# EAGLE board RGBW_Controller (EAGLE 9.4.1)
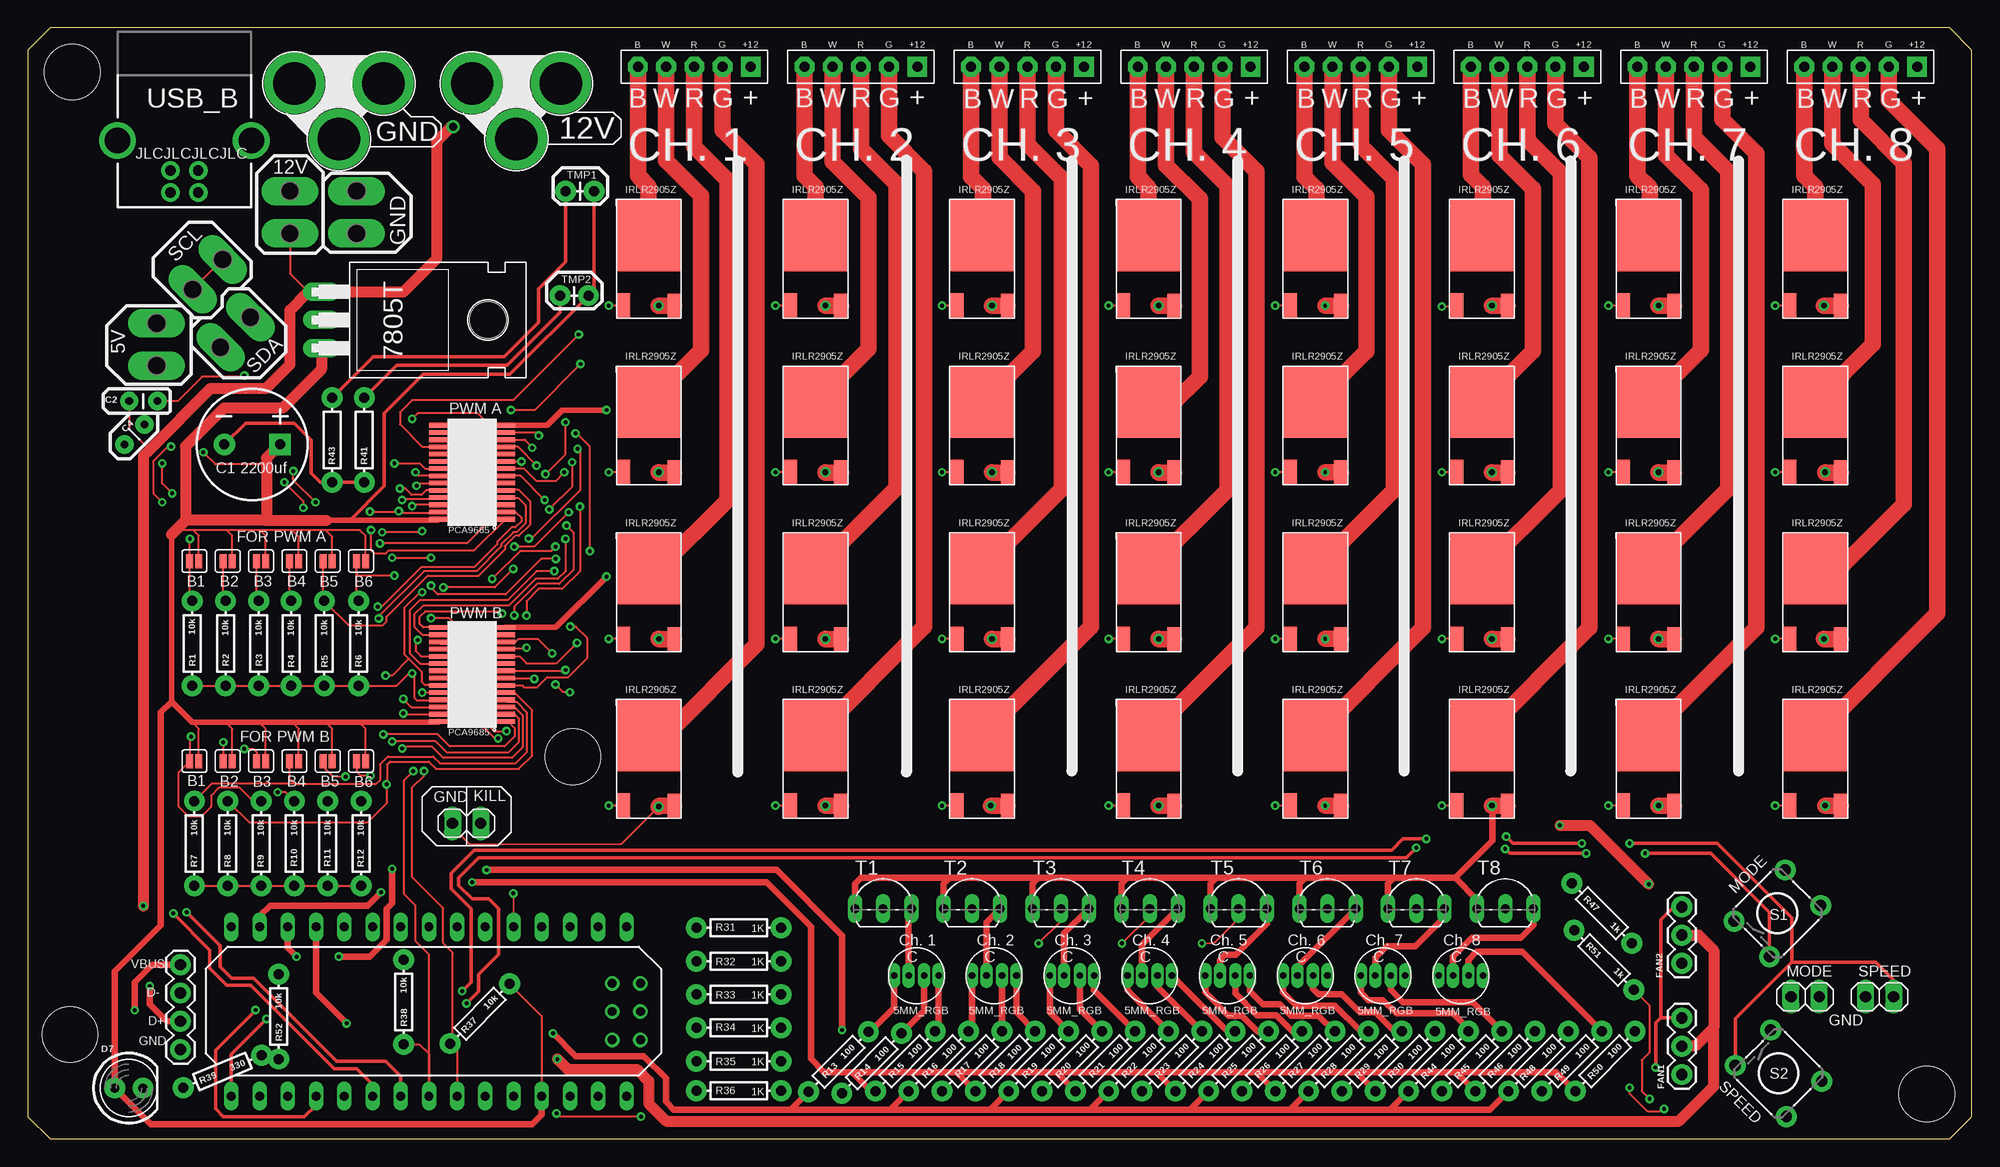
[diagram p1: board, top side]
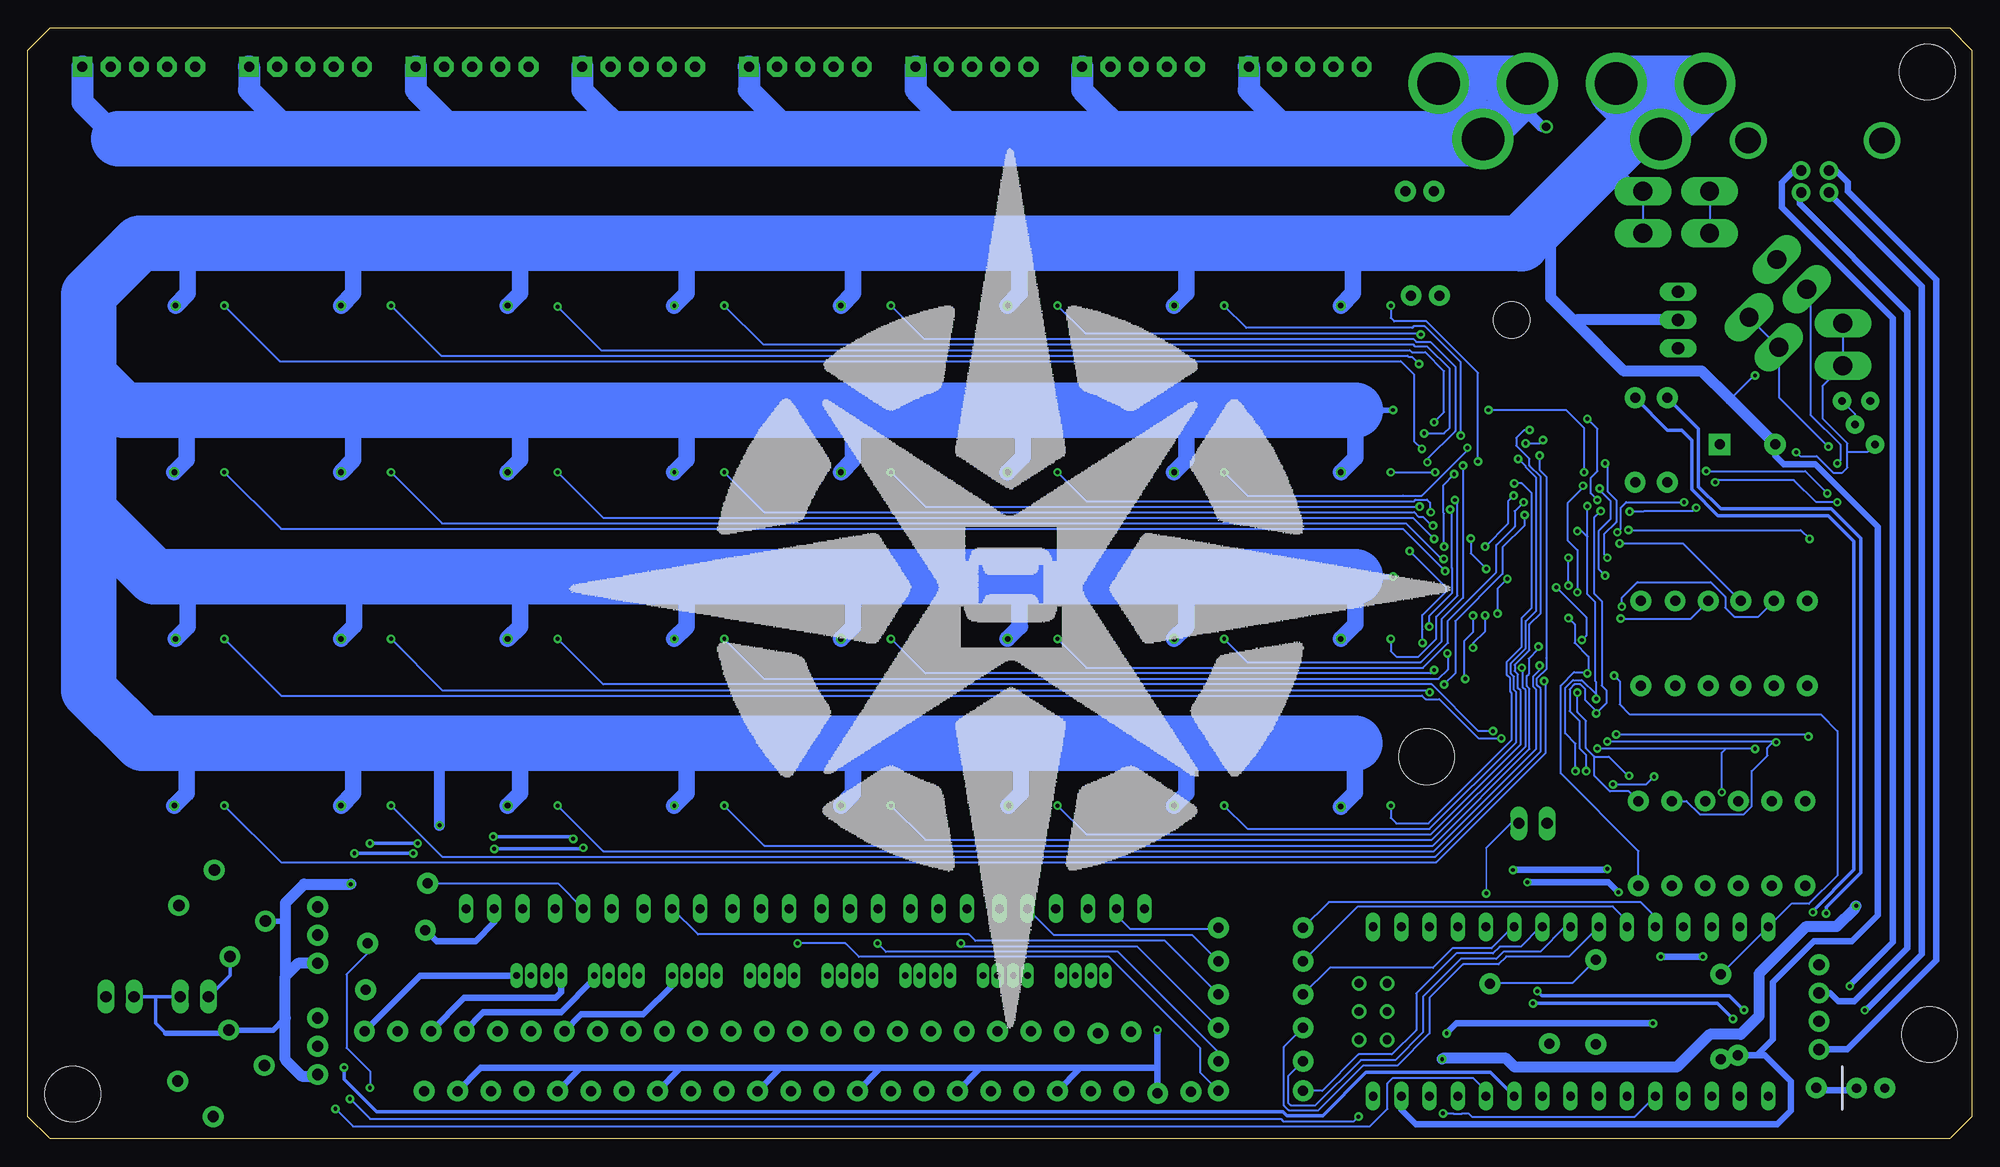
[diagram p2: board, bottom side, seen from below]

Size 175 x 100 mm. Coordinates in mm from the lower left corner, seen from the top.
Outline: 0,98 0,2 2,0 173,0 175,2 175,98 173,100 2,100 0,98
Copper layers (1*16): Top 0.035mm / dielectric 1.5mm / Bottom 0.035mm
Design rules "default": minimum track width 6mil, minimum drill 0.35mm, track to track 6mil, track to pad 6mil, pad to pad 6mil, via to via 6mil, smd to smd 6mil, copper to edge 40mil, drill to drill 6mil, minimum pad ring 10mil, minimum via ring 8mil, stop-mask expansion 4mil, vias tented up to drill 0mil, thermal gap 10mil
Holes 5 mm at 3.8,9.4 4,96.03 170.95,4.05 49.08,34.4

## Footprints (pad centres in the part's own frame; a part is rotated, then mirrored left to right if it is on the bottom)
P2-38-17 = drill 1.702 pad 2.121 long: TP-1 -1.905,0; TP-2 1.905,0
CPOL-RADIAL-5MM-10MM = drill 0.9 pad 1.93 square: + 2.5,0 | drill 0.9 pad 1.93: - -2.5,0
CAP-PTH-2.54 = drill 0.7 pad 1.651: 1 -1.27,0; 2 1.27,0
LED_5MM = drill 0.813 pad 1.88: A -1.27,0; K 1.27,0
1X03 = drill 1.016 pad 1.88: 1 0,0; 2 2.54,0; 3 5.08,0
TO220H = drill 1.118 long: 1 -2.54,-10.16; 2 0,-10.16; 3 2.54,-10.16 | hole 3.302: 0,4.826
USB-B-PTH = drill 0.914 pad 1.676: D+ 4,1.25; D- 5.981,1.25; GND 4,-1.25; VBUS 5.981,-1.25 | drill 2.286: SHLD1 1.282,-6.02; SHLD2 1.282,6.02
SMT-JUMPER_2_NC_PASTE_SILK = smd 0.635 x 1.27: 1 -0.406,0; 2 0.406,0
BANANA_CONN = drill 3.81 pad 5.461: P$1 0,0
1X04 = drill 1.016 pad 1.88: 1 0,0; 2 2.54,0; 3 5.08,0; 4 7.62,0
1X02 = drill 1.016 long: 1 -1.27,0; 2 1.27,0
AXIAL-0.3 = drill 0.9 pad 1.88: P$1 -3.81,0; P$2 3.81,0
AXIAL-0.1 = drill 0.9 pad 1.88: P$1 -1.27,0; P$2 1.27,0
TACTILE_SWITCH_PTH_6.0MM = drill 1.016 pad 1.88: 1 -3.251,2.261; 2 3.251,2.261; 3 -3.251,-2.261; 4 3.251,-2.261
TO92-EBC = drill 0.813 long: B 0,-1.27; C 2.54,-1.27; E -2.54,-1.27
16CH_PWM = smd 0.42 x 1.78: A0 -4.23,-3; A1 -3.58,-3; A2 -2.93,-3; A3 -2.28,-3; A4 -1.63,-3; A5 -1.63,3; EXCL -2.28,3; M0 -0.98,-3; M1 -0.33,-3; M2 0.33,-3; M3 0.98,-3; M4 1.63,-3; M5 2.28,-3; M6 2.93,-3; M7 3.58,-3; M8 4.23,3; M9 3.58,3; M10 2.93,3; M11 2.28,3; M12 1.63,3; M13 0.98,3; M14 0.33,3; M15 -0.33,3; OE -0.98,3; SCL -2.93,3; SDA -3.58,3; VDD -4.23,3; VSS 4.23,-3
MOSFET = smd 5.8 x 6.4: DRAIN 2.9,6.3 | smd 1.2 x 2.2: GATE 0.63,0; SOURCE 5.19,-0.03
NANO = drill 0.8 long: 3.3V -10.16,24.13; 5V -10.16,-1.27; A0 -10.16,19.05; A1 -10.16,16.51; A2 -10.16,13.97; A3 -10.16,11.43; A4 -10.16,8.89; A5 -10.16,6.35; A6 -10.16,3.81; A7 -10.16,1.27; AREF -10.16,21.59; D2 5.08,1.27; D3 5.08,3.81; D4 5.08,6.35; D5 5.08,8.89; D6 5.08,11.43; D7 5.08,13.97; D8 5.08,16.51; D9 5.08,19.05; D10 5.08,21.59; D11 5.08,24.13; D12 5.08,26.67; D13 -10.16,26.67; GND -10.16,-6.35; GND1 5.08,-1.27; RAW -10.16,-8.89; RST -10.16,-3.81; RST1 5.08,-3.81; RX1 5.08,-6.35; TX0 5.08,-8.89 | drill 0.8: ICSP1 -5.08,-10.16; ICSP2 -5.08,-7.62; ICSP3 -2.54,-10.16; ICSP4 -2.54,-7.62; ICSP5 0,-10.16; ICSP6 0,-7.62
5MMRGB = drill 0.6 pad 1 long: BLUE -2,0; GND 0.7,0; GREEN -0.7,0; RED 2,0
5POLE_TERM = drill 0.9 pad 1.778 square: +12 -5.08,1.5 | drill 0.9 pad 1.778 octagon: BLUE 5.08,1.5; GREEN -2.54,1.5; RED 0,1.5; WHITE 2.54,1.5

## Placement (x,y rotation side)
5V  PTR2  [P2-38-17]  11.6,71.5 90 top
12V  PTR2  [P2-38-17]  23.6,83.4 90 top
C1  1mF  [CPOL-RADIAL-5MM-10MM]  20.2,62.5 0 top
C2  22pF  [CAP-PTH-2.54]  10.4,66.4 0 top
C4  22pF  [CAP-PTH-2.54]  9.6,63.4 45 top
D7  [LED_5MM]  9.1,4.58 0 top
FAN1  [1X03]  148.9,5.8 90 top
FAN2  [1X03]  148.9,15.8 90 top
GND  PTR2  [P2-38-17]  29.6,83.4 90 top
IC1  7805T  [TO220H]  36.6,73.7 270 top
J1  USB_B_PTH  [USB-B-PTH]  14.1,91.15 270 top
J1_  JUMPER-SMT_2_NC_PASTE_SILK  [SMT-JUMPER_2_NC_PASTE_SILK]  15,52 180 top
J2  [BANANA_CONN]  48,95 0 top
J2_  JUMPER-SMT_2_NC_PASTE_SILK  [SMT-JUMPER_2_NC_PASTE_SILK]  18,52 180 top
J3  [BANANA_CONN]  44,90 0 top
J3_  JUMPER-SMT_2_NC_PASTE_SILK  [SMT-JUMPER_2_NC_PASTE_SILK]  21,52 180 top
J4  [BANANA_CONN]  40,95 0 top
J4_  JUMPER-SMT_2_NC_PASTE_SILK  [SMT-JUMPER_2_NC_PASTE_SILK]  24,52 180 top
J5  [BANANA_CONN]  32,95 0 top
J5_  JUMPER-SMT_2_NC_PASTE_SILK  [SMT-JUMPER_2_NC_PASTE_SILK]  27,52 180 top
J6  [BANANA_CONN]  28,90 0 top
J6_  JUMPER-SMT_2_NC_PASTE_SILK  [SMT-JUMPER_2_NC_PASTE_SILK]  30,52 180 top
J7  [BANANA_CONN]  24,95 0 top
J7_  JUMPER-SMT_2_NC_PASTE_SILK  [SMT-JUMPER_2_NC_PASTE_SILK]  15,34 180 top
J8  [1X04]  13.75,8.05 90 top
J8_  JUMPER-SMT_2_NC_PASTE_SILK  [SMT-JUMPER_2_NC_PASTE_SILK]  18,34 180 top
J9_  JUMPER-SMT_2_NC_PASTE_SILK  [SMT-JUMPER_2_NC_PASTE_SILK]  21,34 180 top
J10_  JUMPER-SMT_2_NC_PASTE_SILK  [SMT-JUMPER_2_NC_PASTE_SILK]  24,34 180 top
J11_  JUMPER-SMT_2_NC_PASTE_SILK  [SMT-JUMPER_2_NC_PASTE_SILK]  27,34 180 top
J12_  JUMPER-SMT_2_NC_PASTE_SILK  [SMT-JUMPER_2_NC_PASTE_SILK]  30,34 180 top
JP1  [1X02]  39.5,28.4 180 top
JP2  [1X02]  166.7,12.8 180 top
JP3  [1X02]  160,12.8 0 top
R1  10k  [AXIAL-0.3]  26.7,44.6 270 top
R2  10k  [AXIAL-0.3]  23.7,44.6 270 top
R3  10k  [AXIAL-0.3]  20.8,44.6 270 top
R4  10k  [AXIAL-0.3]  17.8,44.6 270 top
R5  10k  [AXIAL-0.3]  14.8,44.6 270 top
R6  10k  [AXIAL-0.3]  18,26.6 270 top
R7  10k  [AXIAL-0.3]  15,26.6 270 top
R8  10k  [AXIAL-0.3]  24,26.6 270 top
R9  10k  [AXIAL-0.3]  27,26.6 270 top
R10  10k  [AXIAL-0.3]  21,26.6 270 top
R11  10k  [AXIAL-0.3]  29.8,44.6 270 top
R12  10k  [AXIAL-0.3]  30,26.6 270 top
R13  100  [AXIAL-0.3]  72.97,6.95 225 top
R14  100  [AXIAL-0.3]  75.97,6.8 225 top
R15  100  [AXIAL-0.3]  79,7 225 top
R16  100  [AXIAL-0.3]  82,7 225 top
R17  100  [AXIAL-0.3]  85,7 225 top
R18  100  [AXIAL-0.3]  88,7 225 top
R19  100  [AXIAL-0.3]  91,7 225 top
R20  100  [AXIAL-0.3]  94,7 225 top
R21  100  [AXIAL-0.3]  97,7 225 top
R22  100  [AXIAL-0.3]  100,7 225 top
R23  100  [AXIAL-0.3]  103,7 225 top
R24  100  [AXIAL-0.3]  106,7 225 top
R25  100  [AXIAL-0.3]  109,7 225 top
R26  100  [AXIAL-0.3]  112,7 225 top
R27  100  [AXIAL-0.3]  115,7 225 top
R28  100  [AXIAL-0.3]  118,7 225 top
R29  100  [AXIAL-0.3]  121,7 225 top
R30  100  [AXIAL-0.3]  124,7 225 top
R31  1k  [AXIAL-0.3]  64,19 0 top
R32  1k  [AXIAL-0.3]  64,16 0 top
R33  1k  [AXIAL-0.3]  64,10 0 top
R34  1k  [AXIAL-0.3]  64,7 0 top
R35  1k  [AXIAL-0.3]  64,4.33 0 top
R36  1k  [AXIAL-0.3]  64,13 0 top
R37  10k  [AXIAL-0.3]  40.7,11.28 225 top
R38  10k  [AXIAL-0.3]  33.85,12.32 270 top
R39  330  [AXIAL-0.3]  17.52,6.08 22.5 top
R40  10  [AXIAL-0.1]  49.2,75.9 0 top
R41  10  [AXIAL-0.3]  30.3,62.9 90 top
R42  10  [AXIAL-0.1]  49.7,85.3 0 top
R43  10  [AXIAL-0.3]  27.4,62.9 90 top
R44  100  [AXIAL-0.3]  127,7 225 top
R45  100  [AXIAL-0.3]  130,7 225 top
R46  100  [AXIAL-0.3]  133,7 225 top
R47  1k  [AXIAL-0.3]  141.7,20.3 135 top
R48  100  [AXIAL-0.3]  136,7 225 top
R49  100  [AXIAL-0.3]  139,7 225 top
R50  100  [AXIAL-0.3]  142,7 225 top
R51  1k  [AXIAL-0.3]  141.9,16.1 135 top
R52  10k  [AXIAL-0.3]  22.6,11 270 top
S1  MOMENTARY-SWITCH-SPST-PTH-6.0MM  [TACTILE_SWITCH_PTH_6.0MM]  157.5,20.3 45 top
S2  MOMENTARY-SWITCH-SPST-PTH-6.0MM  [TACTILE_SWITCH_PTH_6.0MM]  157.6,5.9 315 top
SCL  PTR2  [P2-38-17]  16.2,77.8 45 top
SDA  PTR2  [P2-38-17]  18.7,72.6 45 top
T1  [TO92-EBC]  77,22 0 top
T2  [TO92-EBC]  85,22 0 top
T3  [TO92-EBC]  93,22 0 top
T4  [TO92-EBC]  101,22 0 top
T5  [TO92-EBC]  109,22 0 top
T6  [TO92-EBC]  117,22 0 top
T7  [TO92-EBC]  125,22 0 top
T8  [TO92-EBC]  133,22 0 top
U$1  16CH_PWM  [16CH_PWM]  40,60 90 top
U$2  MOSFET  [MOSFET]  143,75 0 top
U$3  MOSFET  [MOSFET]  143,60 0 top
U$4  MOSFET  [MOSFET]  143,45 0 top
U$5  MOSFET  [MOSFET]  143,30 0 top
U$6  MOSFET  [MOSFET]  83,75 0 top
U$7  MOSFET  [MOSFET]  83,60 0 top
U$8  MOSFET  [MOSFET]  83,45 0 top
U$9  MOSFET  [MOSFET]  83,30 0 top
U$10  MOSFET  [MOSFET]  68,75 0 top
U$11  MOSFET  [MOSFET]  68,60 0 top
U$12  MOSFET  [MOSFET]  68,45 0 top
U$13  MOSFET  [MOSFET]  68,30 0 top
U$14  MOSFET  [MOSFET]  53,75 0 top
U$15  MOSFET  [MOSFET]  53,60 0 top
U$16  MOSFET  [MOSFET]  53,45 0 top
U$17  MOSFET  [MOSFET]  53,30 0 top
U$18  16CH_PWM  [16CH_PWM]  40,41.8 90 top
U$19  MOSFET  [MOSFET]  158,30 0 top
U$20  MOSFET  [MOSFET]  158,45 0 top
U$21  MOSFET  [MOSFET]  158,60 0 top
U$22  MOSFET  [MOSFET]  158,75 0 top
U$23  MOSFET  [MOSFET]  128,30 0 top
U$24  MOSFET  [MOSFET]  128,45 0 top
U$25  MOSFET  [MOSFET]  128,60 0 top
U$26  MOSFET  [MOSFET]  128,75 0 top
U$27  MOSFET  [MOSFET]  113,30 0 top
U$28  MOSFET  [MOSFET]  113,45 0 top
U$29  MOSFET  [MOSFET]  113,60 0 top
U$30  MOSFET  [MOSFET]  113,75 0 top
U$31  MOSFET  [MOSFET]  98,30 0 top
U$32  MOSFET  [MOSFET]  98,45 0 top
U$33  MOSFET  [MOSFET]  98,60 0 top
U$34  MOSFET  [MOSFET]  98,75 0 top
U$35  NANO  [NANO]  45,14 90 top
U$36  5MM_RGB  [5MMRGB]  80,14.7 180 top
U$37  5POLE_TERM  [5POLE_TERM]  60,98 180 top
U$38  5POLE_TERM  [5POLE_TERM]  75,98 180 top
U$39  5POLE_TERM  [5POLE_TERM]  90,98 180 top
U$40  5POLE_TERM  [5POLE_TERM]  105,98 180 top
U$41  5POLE_TERM  [5POLE_TERM]  120,98 180 top
U$42  5POLE_TERM  [5POLE_TERM]  135,98 180 top
U$43  5POLE_TERM  [5POLE_TERM]  150,98 180 top
U$44  5POLE_TERM  [5POLE_TERM]  165,98 180 top
U$45  5MM_RGB  [5MMRGB]  87,14.7 180 top
U$46  5MM_RGB  [5MMRGB]  94,14.7 180 top
U$47  5MM_RGB  [5MMRGB]  101,14.7 180 top
U$48  5MM_RGB  [5MMRGB]  108,14.7 180 top
U$49  5MM_RGB  [5MMRGB]  115,14.7 180 top
U$50  5MM_RGB  [5MMRGB]  122,14.7 180 top
U$51  5MM_RGB  [5MMRGB]  129,14.7 180 top

## Tracks (layer width: path | path; a pad name or v marks a point on that pad's centre or on a via)
5V  (via drill 0.35)
  Top 0.2: J1_.1 15.41,54.3 14.91,54.8 | J2_.1 18.41,54.3 17.91,54.8 | 26.81,54.8 29.9,54.8 30.41,54.29 J6_.1 | 26.81,54.8 23.81,54.8 | 23.81,54.8 20.91,54.8 | 20.91,54.8 17.91,54.8 | 17.91,54.8 14.91,54.8 | 14.91,54.8 12.94,54.8 | J3_.1 21.41,54.3 20.91,54.8 | J4_.1 24.41,54.2 23.81,54.8 | J5_.1 27.41,54.2 26.81,54.8 | J7_.1 15.41,36.89 14.8,37.5 | J8_.1 18.41,36.89 17.8,37.5 | J9_.1 21.41,36.89 20.8,37.5 | J10_.1 24.41,36.89 23.8,37.5 | J11_.1 27.41,36.89 26.8,37.5 | J12_.1 30.41,36.89 29.8,37.5 | U$35.5V 46.27,11.05 43.39,13.93 R37.P$1 | 21.5,60.7 16.9,60.7 v15.8,61.8
  Top 0.3: 29,55.67 32.1,58.77 32.1,65.3 35.6,68.8 43.4,68.8 50.47,75.87 R40.P$2 50.97,76.4 R42.P$2
  Top 0.5: U$1.VDD 36.9,55.67 29,55.67 26.9,55.67 | U$18.VDD 36.93,37.5 29.8,37.5 26.8,37.5 23.8,37.5 20.8,37.5 17.8,37.5 14.8,37.5 12.94,39.36 12.94,54.4 12.94,54.8
  Top 0.6: 12.94,39.36 11.98,38.4 11.98,19.25 7.83,15.1 D7.A 11.09,1.32 45.4,1.32 46.27,2.19 U$35.5V
  Top 1: IC1.3 26.44,69.26 22.94,65.76 17.64,65.76 14.21,62.33 14.21,55.67 | 21.5,55.67 26.9,55.67 | C1.+ 21.5,61.3 21.5,60.7 21.5,55.67 | 21.5,55.67 14.21,55.67 | 14.21,55.67 12.94,54.4
  Bottom 0.2: R38.P$1 35.92,14.07 43.29,14.07 R37.P$1 | 5V.TP-2 5V.TP-1 13.4,67.8 13.4,64.8 11.2,62.6 11.2,61.8 | v15.8,61.8 15.45,61.45 13.95,61.45 12.47,59.97 11.64,59.97 11.2,60.41 11.2,61.8 | C4.1 9.4,61.8 11.2,61.8
12V  (via drill 0.35, 0.75)
  Top 0.2: 12V.TP-1 23.6,77.88 25.24,76.24 | C2.1 9.13,63.87 10.96,62.04
  Top 1: v38.3,91.1 38.1,91.1 36.8,89.8 36.8,79.2 33.8,76.2 26.48,76.2 IC1.1 25.24,76.24 23.6,74.6 23.6,69.7 21.44,67.54 16.46,67.54 10.96,62.04 10.4,61.48 v10.4,20.98 | FAN2.2 150.43,18.34 151.78,16.99 151.78,10 | 151.78,10 150.12,8.34 FAN1.2 | v47.67,7.17 48.6,6.25 54.85,6.25 55.9,5.2 55.9,3.17 57.48,1.6 148.65,1.6 151.78,4.72 151.78,10
  Bottom 0.2: 12V.TP-2 12V.TP-1
  Bottom 1: v38.3,91.1 38.7,91.1 40,92.4 J4.P$1 | v10.4,20.98 10.5,20.88 10.5,20.77 12.15,19.12 14.88,19.12 19.15,14.85 19.15,11.05 20.8,9.4 23.6,9.4 26.55,6.45 41.14,6.45 41.99,7.3 47.55,7.3 v47.67,7.17
  Bottom 2: U$37.+12 65.08,94.38 60.7,90 | U$38.+12 80.08,94.38 75.7,90 | U$39.+12 95.08,94.38 90.7,90 | U$40.+12 110.08,94.38 105.7,90 | U$41.+12 125.08,94.38 120.7,90 | U$42.+12 140.08,94.38 135.7,90 | U$43.+12 155.08,94.38 150.7,90 | U$44.+12 170.08,93.28 166.8,90 | J3.P$1 43.65,90.35 43.65,90.65
  Bottom 4: J4.P$1 40,94.3 43.65,90.65 J2.P$1 47.5,95.5 40.5,95.5 J4.P$1
  Bottom 5: J3.P$1 60.7,90 75.7,90 90.7,90 105.7,90 120.7,90 135.7,90 150.7,90 166.8,90
GND  (via drill 0.35, 0.5)
  Top 0.152: 56.87,29.97 53.4,26.5 39.8,26.5
  Top 0.2: U$1.VSS 41.57,64.23 40.5,65.3 35.1,65.3 v34.6,64.8 | U$18.VSS 38.77,46.03 37.93,46.87 v36.3,46.87 | U$18.EXCL 36.98,39.5 35,39.5 34.8,39.7 34.8,41.7 v34.6,41.9 34.31,41.9 33.2,40.79 R11.P$2 R1.P$2 R2.P$2 R3.P$2 R4.P$2 R5.P$2 | U$1.EXCL 36.88,57.6 33.8,57.6 v33.7,57.5 | R7.P$2 R6.P$2 R10.P$2 R8.P$2 R9.P$2 R12.P$2 | C2.2 13.5,66.4 15.7,68.6 19.4,68.6 v19.5,68.7 | 39.8,26.5 38.23,28.07 JP1.2
  Top 0.3: C1.- 19.6,64.4 24,64.4 25.5,62.9 25.5,59.9 26.31,59.09 R43.P$1 R41.P$1
  Top 0.5: U$1.VSS 46.73,64.23 48.1,65.6 v52.1,65.6 | U$18.VSS 47.53,46.03 v52.1,50.6
  Top 0.6: 83,23.5 91,23.5 | 91,23.5 99,23.5 | 99,23.5 107,23.5 | 107,23.5 115,23.5 | 115,23.5 123,23.5 | 123,23.5 128.5,23.5 | 128.5,23.5 131.83,26.83 131.83,29.97 | 115,23.5 114.46,22.96 T6.E | T5.E 106.46,22.96 107,23.5 | T4.E 98.46,22.96 99,23.5 | T3.E 90.46,22.96 91,23.5 | T2.E 82.46,22.96 83,23.5 | T1.E 74.46,22.96 75,23.5 83,23.5 | T7.E 122.46,22.96 123,23.5 | 128.5,23.5 130.46,21.54 T8.E
  Top 1: v145.93,22.93 140.62,28.23 v137.93,28.23
  Top 1.5: U$22.SOURCE 161.73,74.97 v161.7,75 | U$2.SOURCE 146.83,74.97 v146.8,75 | U$26.SOURCE 131.83,74.97 v131.8,75 | U$34.SOURCE 101.83,74.97 v101.8,75 | U$6.SOURCE 86.83,74.97 v86.8,75 | U$10.SOURCE 71.83,74.97 v71.8,75 | U$14.SOURCE 56.83,74.97 v56.8,75 | U$21.SOURCE 161.83,59.97 v161.8,60 | U$3.SOURCE 146.83,59.97 v146.8,60 | U$25.SOURCE 131.83,59.97 v131.8,60 | U$33.SOURCE 101.83,59.97 v101.8,60 | U$7.SOURCE 86.83,59.97 v86.8,60 | U$11.SOURCE 71.83,59.97 v71.8,60 | U$15.SOURCE 56.83,59.97 v56.8,60 | U$16.SOURCE 56.83,44.97 v56.8,45 | U$12.SOURCE 71.83,44.97 v71.8,45 | U$8.SOURCE 86.83,44.97 v86.8,45 | U$32.SOURCE 101.83,44.97 v101.8,45 | U$24.SOURCE 131.83,44.97 v131.8,45 | U$4.SOURCE 146.83,44.97 v146.8,45 | U$20.SOURCE 161.73,44.97 v161.7,45 | U$17.SOURCE 56.87,29.97 v56.8,29.9 | U$13.SOURCE 71.83,29.97 v71.8,30 | U$9.SOURCE 86.73,29.97 v86.7,30 | U$31.SOURCE 101.83,29.97 v101.8,30 | U$23.SOURCE 131.83,29.97 v131.8,30 | U$5.SOURCE 146.83,29.97 v146.8,30 | U$19.SOURCE 161.83,29.97 v161.8,30 | v116.8,45 118.16,45 U$28.SOURCE | v116.8,60 118.16,60 U$29.SOURCE | v116.8,75 118.16,75 U$30.SOURCE | v116.8,30 118.16,30 U$27.SOURCE
  Bottom 0.2: v34.6,64.8 33.7,63.9 33.7,60.1 34.3,59.5 34.3,58.1 v33.7,57.5 | 34.6,42 v34.6,41.9 | v36.3,46.87 35.73,46.3 35.73,44.64 34.5,43.41 34.5,42 34.6,42 | 34.6,42 35.8,42 37,40.8 37,32.89 30,25.89 R12.P$2 | R39.P$2 21.39,7.19 R52.P$2 | GND.TP-1 GND.TP-2 32.74,88.45 32.75,88.45 | C4.2 10.5,65.23 C2.2 | 21.75,66.55 19.6,68.7 v19.5,68.7
  Bottom 0.3: 162.6,9.5 163.5,10.4 163.5,12.8 | JP3.2 163.5,12.8 | JP2.2 163.5,12.8
  Bottom 0.5: v52.1,65.6 55.5,65.6 | v52.1,50.6 55.5,50.6 | S1.1 151.82,19.6 | 151.82,19.6 | 151.82,10.9 152.93,9.8 S2.1 157.2,9.5 162.6,9.5
  Bottom 0.6: U$35.GND 51.35,2.64 50.03,1.32 17.48,1.32 16.27,2.52 16.27,5.2 18.61,7.53 19.35,7.53 | R39.P$2 19.35,7.53 | 19.35,7.53 17.91,8.97 17.91,14.11 14.22,17.8 10.8,17.8 8.47,20.13 8.47,55.08 14.1,60.7 16.9,60.7 17.7,61.5 C1.-
  Bottom 1: 40.52,80.55 37.9,80.55 37.9,75.7 35.75,73.55 | FAN2.1 150.68,15.8 151.82,14.65 | 151.82,14.65 151.82,10.9 151.82,7.12 150.35,5.65 149.05,5.65 FAN1.1 | 151.82,14.65 151.82,19.6 151.82,21.23 150.12,22.93 v145.93,22.93 | v137.93,28.23 137.93,35.4 137.72,35.6 | C1.- 21.75,66.55 24.3,69.1 31.3,69.1 35.75,73.55 | IC1.2 35.6,73.7 35.75,73.55
  Bottom 1.5: v161.7,75 160.6,76.1 160.6,80.6 | v146.8,75 145.7,76.1 145.7,80.6 | v131.8,75 130.7,76.1 130.7,80.6 | v116.8,75 115.7,76.1 115.7,80.6 | v101.8,75 100.7,76.1 100.7,80.6 | v86.8,75 85.7,76.1 85.7,80.6 | v71.8,75 70.7,76.1 70.7,80.6 | v56.8,75 55.7,76.1 55.7,80.6 | v161.8,60 160.7,61.1 160.7,65.6 | v146.8,60 145.7,61.1 145.7,65.6 | v131.8,60 130.7,61.1 130.7,65.6 | v116.8,60 115.7,61.1 115.7,65.6 | v101.8,60 100.7,61.1 100.7,65.6 | v71.8,60 70.7,61.1 70.7,65.6 | v56.8,60 55.5,61.3 55.5,65.6 | v56.8,45 55.5,46.3 55.5,50.6 | v71.8,45 70.7,46.1 70.7,50.6 | v86.8,45 85.7,46.1 85.7,49.4 86.3,50 85.7,50.6 84.9,50.6 | v101.8,45 100.7,46.1 100.7,50.6 | v116.8,45 115.7,46.1 115.7,50.6 | v146.8,45 145.6,46.2 145.6,50.6 | v161.7,45 160.6,46.1 160.6,50.6 | v131.8,45 130.7,46.1 130.7,50.6 | v56.8,29.9 55.55,31.15 55.55,35.6 | v71.8,30 70.7,31.1 70.7,35.6 | v86.7,30 85.6,31.1 85.6,35.6 | v101.8,30 100.7,31.1 100.7,35.6 | v116.8,30 115.7,31.1 115.7,35.6 | v131.8,30 130.7,31.1 130.7,36.7 131.2,36.2 131.2,35.6 | v146.8,30 145.7,31.1 145.7,35.6 | v86.8,60 85.4,61.4 85.4,65.6 | v161.8,30 160.7,31.1 160.7,35.6
  Bottom 5: 28,90.4 28,91 J7.P$1 J5.P$1 | 28,90.4 J6.P$1 | 169.5,68.7 169.5,76 164.9,80.6 160.6,80.6 145.7,80.6 130.7,80.6 115.7,80.6 100.7,80.6 85.7,80.6 70.7,80.6 55.7,80.6 40.6,80.6 | 169.5,68.7 169.5,56.5 | 169.5,56.5 169.5,40.4 164.7,35.6 160.7,35.6 145.7,35.6 137.72,35.6 131.2,35.6 115.7,35.6 100.7,35.6 85.6,35.6 70.7,35.6 55.55,35.6 | 169.5,56.5 163.6,50.6 160.6,50.6 145.6,50.6 130.7,50.6 115.7,50.6 100.7,50.6 84.9,50.6 70.7,50.6 55.5,50.6 | 169.5,68.7 166.4,65.6 160.7,65.6 145.7,65.6 130.7,65.6 115.7,65.6 100.7,65.6 85.4,65.6 70.7,65.6 55.5,65.6 | 40.6,80.6 32.75,88.45 30.4,90.8 30.4,94.4 31,95 J5.P$1 | 40.52,80.55 40.55,80.55 40.6,80.6 | J5.P$1 32,94.4 28,90.4
N$1  (via drill 0.35)
  Top 0.2: U$18.A5 v35.5,40.17 | J12_.2 29.59,33.06 29.98,32.68 v30.85,32.68
  Bottom 0.2: v30.85,32.68 30.95,32.68 32.68,34.41 33.96,34.41 | 33.96,34.41 34.73,35.17 34.73,37.63 35.5,38.4 v35.5,40.17 | R12.P$1 30.86,31.27 32.56,31.27 33.96,32.67 33.96,34.41
N$2  (via drill 0.35)
  Top 0.6: R15.P$2 75.91,4.31 74.21,6.01 | v40,23.1 66.5,23.1 70.5,19.1 70.5,7.2 71.69,6.01 74.21,6.01 | v31.8,22.2 30.6,21 21.8,21 20.87,20.07 U$35.D11 | 74.21,6.01 83.61,6.01 | 83.61,6.01 R18.P$2 | 83.61,6.01 92.61,6.01 | 92.61,6.01 R21.P$2 | 92.61,6.01 101.61,6.01 | 101.61,6.01 R24.P$2 | 101.61,6.01 110.61,6.01 | 110.61,6.01 119.61,6.01 | 119.61,6.01 R30.P$2 | 119.61,6.01 128.61,6.01 | 128.61,6.01 R46.P$2 | 128.61,6.01 137.61,6.01 R50.P$2 | R27.P$2 110.61,6.01
  Bottom 0.6: v40,23.1 32.7,23.1 v31.8,22.2
N$3
  Top 0.6: U$36.RED 78,11.8 75.84,9.64 R13.P$1
N$4
  Top 0.6: U$36.GREEN 80.7,11.53 R14.P$1
N$5  (via drill 0.35)
  Top 0.2: R11.P$1 29.59,48.62 29.59,50.9 | 29.59,50.9 J6_.2 | v33,50.7 29.79,50.7 29.59,50.9 | v33.5,58.54 33.96,58.54 34.55,57.95 35.45,57.95 35.87,58.37 U$1.A5
  Bottom 0.2: v33,50.7 33.6,51.3 33.6,54.7 32.5,55.8 32.5,57.4 33.45,58.35 33.45,58.49 v33.5,58.54
N$6
  Top 0.6: U$36.BLUE 82,10 R15.P$1
N$7  (via drill 0.35)
  Top 0.2: U$19.GATE v157.3,30 | v38.5,41.2 38.23,41.47 U$18.M15
  Bottom 0.2: v157.3,30 152.2,24.9 48.2,24.9 38.4,34.7 38.4,41.1 v38.5,41.2
N$8  (via drill 0.35)
  Top 0.2: U$20.GATE v157.3,45 | v42.35,36.05 42.05,36.05 39.8,38.29 39.8,40.81 38.48,42.13 U$18.M14
  Bottom 0.2: v157.3,45 152.2,39.9 49.49,39.9 49.16,39.57 47.92,39.57 44.4,36.05 v42.35,36.05
N$9  (via drill 0.35)
  Top 0.2: U$21.GATE v157.3,60 | v47.4,51.1 45.8,51.1 43.2,48.5 35.3,48.5 34.4,47.6 34.4,43.7 35.32,42.78 U$18.M13
  Bottom 0.2: v157.3,60 152.2,54.9 51.2,54.9 v47.4,51.1
N$10  (via drill 0.35)
  Top 0.2: U$2.GATE v142.3,75 | U$1.M15 35.23,59.67 v34.9,60 | v49.75,69.74 45.61,65.6 v43.5,65.6
  Bottom 0.2: v142.3,75 137.8,70.5 50.8,70.5 50.65,70.35 50.36,70.35 v49.75,69.74 | v34.9,60 34.9,64 36.5,65.6 v43.5,65.6
N$11  (via drill 0.35)
  Top 0.2: U$3.GATE v142.3,60 | v47.53,52.2 46.23,52.2 43.03,49 36.9,49 36.3,49.6 v36.3,49.8 | v33,60.8 35.3,60.8 35.77,60.33 U$1.M14 | v32.8,52.3 v36.3,52.3
  Bottom 0.2: v142.3,60 137.7,55.4 50.93,55.4 47.73,52.2 v47.53,52.2 | v33,60.8 32.8,60.6 32.8,58.3 32,57.5 32,55.5 33.1,54.4 33.1,52.6 v32.8,52.3 | v36.3,49.8 v36.3,52.3
N$12  (via drill 0.35)
  Top 0.2: U$4.GATE v142.3,45 | v48.8,40.2 48.2,40.2 v47.5,40.9 | U$1.M13 37.01,60.99 38.2,60.99 38.74,60.45 38.74,57.66 v40.25,56.15
  Bottom 0.2: v142.3,45 137.7,40.4 49,40.4 v48.8,40.2 | v47.5,40.9 46.5,41.9 46.5,46.6 42.25,50.85 42.25,53.25 40.25,55.25 v40.25,56.15
N$13  (via drill 0.35)
  Top 0.2: U$5.GATE v142.3,30 | U$1.M12 38.77,61.63 v38.9,61.5
  Bottom 0.2: v142.3,30 137.7,25.4 48.3,25.4 38.8,34.9 38.8,40.51 39.13,40.84 39.13,41.47 38.27,42.33 38.27,43.26 38.3,43.29 38.3,59.6 38.9,60.2 v38.9,61.5
N$14
  Bottom 0.6: R39.P$1 13.79,4.4 10.54,4.4 D7.K
N$15
  Top 1.5: U$43.BLUE 144.92,86.68 146,85.6 146,81.4 U$2.DRAIN
N$16
  Top 0.6: U$45.RED 85,10 R16.P$1
N$17
  Top 0.6: U$45.GREEN R17.P$1
N$18  (via drill 0.35)
  Top 0.2: R5.P$1 14.59,48.62 J1_.2 v14.59,53.99 v14.6,54 | v30.9,54.8 30.87,54.77 30.87,53.04 31.21,52.7 32.23,52.7 32.5,52.97 40.2,52.97 U$1.A0
  Bottom 0.2: v30.9,54.8 15.4,54.8 v14.6,54
N$19  (via drill 0.35)
  Top 0.2: U$6.GATE v82.3,75 | v49.6,72.39 43.7,66.49 34.59,66.49 33.5,65.4 33.5,64.3 35.52,62.28 U$1.M11
  Bottom 0.2: v82.3,75 79.8,72.5 49.71,72.5 v49.6,72.39
N$20  (via drill 0.35)
  Top 0.2: U$7.GATE v82.3,60 | v48.7,56.4 45.6,53.3 v43.8,53.3 | U$1.M10 37.03,62.9 v38.6,62.9 | v40.16,62.6 40.16,58.97 v41.23,57.9
  Bottom 0.2: v82.3,60 79.7,57.4 50.19,57.4 50.06,57.53 49.04,57.53 48.77,57.26 48.77,56.47 v48.7,56.4 | v40.16,62.6 38.9,62.6 v38.6,62.9 | v43.8,53.3 41.73,55.37 41.73,57.4 v41.23,57.9
N$21  (via drill 0.35)
  Top 0.2: U$8.GATE v82.3,45 | U$1.M9 37.01,63.59 38.9,63.59 39.53,62.96 39.53,62.34 39.7,62.17 39.7,57.94 v40.34,57.3
  Bottom 0.2: v82.3,45 79.7,42.4 49.4,42.4 47.15,44.65 47.15,46.64 42.8,51 42.8,53.44 41.13,55.1 41.13,56.5 v40.34,57.3
N$22  (via drill 0.35)
  Top 0.2: U$9.GATE v82.3,30 | v39.8,63.8 39.37,64.23 U$1.M8
  Bottom 0.2: v82.3,30 79.7,27.4 48.7,27.4 40.6,35.5 40.6,40.31 40.84,40.56 40.84,41.81 41.13,42.1 41.13,42.66 39.8,43.99 39.8,46.3 38.8,47.3 38.8,59.6 39.8,60.6 39.8,61.2 41,62.4 41,63.1 40.3,63.8 v39.8,63.8
N$23
  Top 0.6: U$45.BLUE 89,11.39 R18.P$1
N$24
  Top 0.6: U$46.RED 92,11.39 R19.P$1
N$25
  Top 0.6: U$46.GREEN 94.7,11.69 R20.P$1
N$26
  Top 0.6: U$46.BLUE 96,13.39 R21.P$1
N$27  (via drill 0.35)
  Top 0.2: U$22.GATE v157.3,75 | v49.5,62.1 49.7,61.9 49.7,58.4 45.33,54.03 v45.1,54.03 | v43.7,51.3 42.03,49.63 v37.4,49.63 | v35.1,44.9 34.9,44.7 34.9,43.93 35.4,43.43 U$18.M12
  Bottom 0.2: v157.3,75 152.3,70 51.4,70 50.2,68.8 50.2,62.8 v49.5,62.1 | v45.1,54.03 45.1,52.7 v43.7,51.3 | v37.4,49.63 34.7,46.93 34.7,45.3 v35.1,44.9
N$28  (via drill 0.35)
  Top 0.2: U$10.GATE v67.3,75 | U$1.M7 45.72,63.58 v46,63.3
  Bottom 0.2: v67.3,75 65.3,73 50.37,73 50.24,73.12 49.24,73.12 46,69.89 v46,63.3
N$29  (via drill 0.35)
  Top 0.2: U$11.GATE v67.3,60 | U$1.M6 44.73,62.93 45.4,62.26 v45.4,62.2
  Bottom 0.2: v67.3,60 65.2,57.9 51.2,57.9 49.5,57.9 45.4,62 v45.4,62.2
N$30  (via drill 0.35)
  Top 0.2: U$12.GATE v67.3,45 | v45.8,60.6 44.12,62.28 U$1.M5
  Bottom 0.2: v67.3,45 65.2,42.9 49.6,42.9 47.7,44.8 47.7,46.8 45.8,48.7 v45.8,60.6
N$31  (via drill 0.35)
  Top 0.2: U$13.GATE v67.3,30 | v40.83,61.2 41.26,61.63 U$1.M4
  Bottom 0.2: v67.3,30 65.2,27.9 48.8,27.9 41,35.7 41,40.22 41.2,40.41 41.2,41.59 41.48,41.88 41.48,42.81 40.15,44.14 40.15,46.6 39.2,47.55 39.2,59.5 40.15,60.46 40.15,60.52 v40.83,61.2
N$32
  Top 0.6: U$47.RED 99,13.39 R22.P$1
N$33
  Top 0.6: U$47.GREEN 101.7,13.69 R23.P$1
N$34
  Top 0.6: U$47.BLUE 108.01,9.69 R24.P$1
N$35
  Top 0.6: U$48.RED 106,13.2 108.1,11.1 109.3,11.1 110.71,9.69 R25.P$1
N$36
  Top 1.5: U$44.BLUE 159.92,86.68 160.9,85.7 U$22.DRAIN
N$37  (via drill 0.35)
  Top 0.2: U$14.GATE v52.3,75 | v44.45,60.96 43.02,60.96 U$1.M3
  Bottom 0.2: v52.3,75 52.3,73.9 51.98,73.58 49.08,73.58 44.45,68.95 v44.45,60.96
N$38  (via drill 0.35)
  Top 0.2: U$15.GATE v52.3,60 | v48.3,60 47.5,59.2 45.8,59.2 44.67,60.33 U$1.M2
  Bottom 0.2: v52.3,60 v48.3,60
N$39  (via drill 0.35)
  Top 0.2: U$16.GATE v52.3,45 | v46.53,57.5 44.36,59.67 U$1.M1
  Bottom 0.2: v52.3,45 52.3,43.9 51.8,43.4 49.8,43.4 48.2,45 48.2,47 46.3,48.9 46.3,57.27 v46.53,57.5
N$40  (via drill 0.35)
  Top 0.2: U$17.GATE v52.3,30 | v41.18,59 41.2,59.02 U$1.M0
  Bottom 0.2: v52.3,30 52.3,28.9 51.8,28.4 48.9,28.4 41.4,35.9 41.4,40.12 41.55,40.27 41.55,41.45 41.84,41.74 41.84,42.95 40.51,44.28 40.51,46.9 39.6,47.8 39.6,58.1 40.5,59 v41.18,59
N$41
  Top 0.6: U$48.GREEN 108.7,13.1 110.67,11.13 112.41,11.13 113.84,9.69 R26.P$1
N$42
  Top 0.6: U$48.BLUE 110,13.3 111.2,12.1 112.7,12.1 113.7,11.1 116.2,11.1 117.61,9.69 R27.P$1
N$43
  Top 0.6: U$49.RED 113,13.2 114.2,12 117.69,12 119.99,9.69 R28.P$1
N$44
  Top 0.6: U$49.GREEN 115.7,13.5 116.2,13 118.3,13 119.9,11.4 121.3,11.4 121.75,10.95 123.01,9.69 R29.P$1
N$45
  Top 1.5: U$44.WHITE 162.46,89.54 166.1,85.9 166.1,71.5 U$21.DRAIN
N$46
  Top 1.5: U$44.RED 165,91.7 168.9,87.8 168.9,57.1 163.1,51.3 U$20.DRAIN
N$47
  Top 1.5: U$44.GREEN 167.54,93.46 171.9,89.1 171.9,47.3 U$19.DRAIN
N$48  (via drill 0.35)
  Top 0.2: R4.P$1 17.59,48.62 J2_.2 | U$1.A1 43.92,56.41 44.44,55.88 44.44,55.58 43.9,55.03 43.57,55.03 42.27,53.73 42.27,53.52 40.2,51.45 35.42,51.45 31.87,47.9 v31.5,47.9
  Bottom 0.2: v31.5,47.9 31.5,48.7 30.1,50.1 23.5,50.1 22.19,48.79 22.19,47.82 21.38,47.01 19.2,47.01 R4.P$1
N$49  (via drill 0.35)
  Top 0.2: U$23.GATE v127.3,30 | v38.9,42.6 38.14,43.36 38.14,43.74 37.81,44.08 U$18.M11
  Bottom 0.2: v127.3,30 123.2,25.9 48.4,25.9 39.2,35.1 39.2,40.41 39.48,40.69 39.48,41.62 38.9,42.2 v38.9,42.6
N$50  (via drill 0.35)
  Top 0.2: U$24.GATE v127.3,45 | U$18.M10 37.19,44.54 37.99,44.54 38.14,44.4 38.14,44.25 39.53,42.86 39.53,41.58 40.15,40.95 40.15,38.54 41.99,36.7 v43.1,36.7
  Bottom 0.2: v127.3,45 123.2,40.9 48.6,40.9 44.4,36.7 v43.1,36.7
N$51  (via drill 0.35)
  Top 0.2: U$25.GATE v127.3,60 | U$18.M9 35.52,45.38 34.8,46.1 34.8,47.2 35.6,48 43.3,48 45.7,50.4 47.7,50.4 48.4,51.1 v48.4,54
  Bottom 0.2: v127.3,60 123.2,55.9 50.3,55.9 v48.4,54
N$52  (via drill 0.35)
  Top 0.2: U$26.GATE 128.53,74.9 v127.3,74.9 | U$18.M8 35.57,46.03 35.3,46.3 35.3,47 35.8,47.5 42.46,47.5 v42.69,47.27 | v41.8,50.4 44.35,52.95 47.15,52.95 v47.5,53.3 | v46.6,59.83 48.4,61.63 v48.4,64.5
  Bottom 0.2: v127.3,74.9 123.4,71 50.6,71 50.4,70.8 49.2,70.8 47.5,69.1 47.5,65.4 v48.4,64.5 | v42.69,47.27 42.69,49.51 v41.8,50.4 | v47.5,53.3 47.5,56.3 47.59,56.38 47.59,58.81 46.6,59.8 v46.6,59.83
N$53
  Top 1.5: U$42.BLUE 129.92,86.78 131,85.7 131,81.4 U$26.DRAIN
N$54
  Top 1.5: U$42.WHITE 132.46,88.54 135.5,85.5 135.5,70.9 U$25.DRAIN
N$55
  Top 1.5: U$42.RED 135,89.9 138,86.9 138,58.4 U$24.DRAIN
N$56
  Top 1.5: U$42.GREEN 137.54,91.36 140.6,88.3 140.6,46 U$23.DRAIN
N$57  (via drill 0.35)
  Top 0.2: U$27.GATE v112.3,30 | v39,44.3 39,44.7 39.7,45.4 42.98,45.4 U$18.M7
  Bottom 0.2: v112.3,30 108.7,26.4 48.5,26.4 39.8,35.1 39.8,40.51 40.03,40.75 40.03,41.67 39.87,41.84 39.87,43.23 39,44.1 v39,44.3
N$58  (via drill 0.35)
  Top 0.2: U$28.GATE v112.3,45 | U$18.M6 43.01,44.72 43.9,44.72 44.18,45 45.9,45 v47.2,43.7
  Bottom 0.2: v112.3,45 108.7,41.4 48.01,41.4 47.17,42.24 47.17,43.67 v47.2,43.7
N$59  (via drill 0.35)
  Top 0.2: U$29.GATE v112.3,60 | v48.5,55.2 49.13,54.57 49.13,51.23 47.85,49.95 45.85,49.95 43.8,47.9 v43.8,47.11 | v44.9,44.2 44.8,44.1 43.02,44.1 U$18.M5
  Bottom 0.2: v112.3,60 108.7,56.4 50.19,56.4 49.76,55.97 49.37,55.97 48.6,55.2 v48.5,55.2 | v44.9,44.2 44.9,44.6 43.8,45.7 v43.8,47.11
N$60  (via drill 0.35)
  Top 0.2: U$30.GATE v112.3,75 | U$18.M4 44.27,43.43 44.9,42.8 47.6,42.8 v49.45,44.65 | v50.6,52.9 50.6,62.3 49.4,63.5 v49.3,63.5
  Bottom 0.2: v112.3,75 108.8,71.5 50.3,71.5 50.11,71.31 49.01,71.31 47,69.3 47,64 47.5,63.5 v49.3,63.5 | v49.45,44.65 49.45,45.82 49.46,45.84 49.46,47.14 47.3,49.3 47.3,49.6 v50.6,52.9
N$61
  Top 1.5: U$41.BLUE 114.92,86.58 116,85.5 116,81.4 U$30.DRAIN
N$62
  Top 1.5: U$41.WHITE 117.46,87.84 120.5,84.8 120.5,70.9 U$29.DRAIN
N$63
  Top 1.5: U$41.RED 120,89.4 123,86.4 123,58.4 U$28.DRAIN
N$64
  Top 1.5: U$41.GREEN 122.54,90.76 125.6,87.7 125.6,46 U$27.DRAIN
N$65  (via drill 0.35)
  Top 0.2: U$31.GATE v97.3,30 | v40.5,42.4 40.88,42.78 U$18.M3
  Bottom 0.2: v97.3,30 94.2,26.9 48.6,26.9 40.15,35.35 40.15,40.37 40.4,40.61 40.4,42.3 v40.5,42.4
N$66  (via drill 0.35)
  Top 0.2: U$32.GATE v97.3,45 | U$18.M2 48.33,42.13 v48.4,42.2
  Bottom 0.2: v97.3,45 94.2,41.9 48.7,41.9 v48.4,42.2
N$67  (via drill 0.35)
  Top 0.2: U$33.GATE v97.3,60 | v49.7,56.9 49.7,51.1 48.1,49.5 46,49.5 44.9,48.4 v44.9,47.1 | v45.6,41.4 43.07,41.4 U$18.M1
  Bottom 0.2: v97.3,60 94.2,56.9 v49.7,56.9 | v44.9,47.1 44.9,45.6 45.7,44.8 45.7,41.5 v45.6,41.4
N$68  (via drill 0.35)
  Top 0.2: U$34.GATE v97.3,75 | v48.83,46.1 49.33,46.1 50.33,45.1 50.33,43.24 48.66,41.57 46.76,41.57 45.86,40.67 44.64,40.67 44.49,40.82 U$18.M0 | v49,60.9 49,58.69 v46.95,56.65
  Bottom 0.2: v97.3,75 94.3,72 50.28,72 50.01,71.74 48.74,71.74 46.5,69.5 46.5,63.69 49,61.19 v49,60.9 | v48.83,46.1 48.83,47.07 46.77,49.13 46.77,51.36 46.8,51.39 46.8,56.49 v46.95,56.65
N$69
  Top 1.5: U$40.BLUE 99.92,86.58 100.9,85.6 U$34.DRAIN
N$70
  Top 1.5: U$40.WHITE 102.46,87.64 105.5,84.6 105.5,68.6 103.2,66.3 U$33.DRAIN
N$71
  Top 1.5: U$40.RED 105,88.8 108,85.8 108,60.7 108,58.4 U$32.DRAIN
N$72
  Top 1.5: U$40.GREEN 107.54,90.16 110.6,87.1 110.6,46 U$31.DRAIN
N$73
  Bottom 0.6: U$49.BLUE 117,13.8 119.6,11.2 125.19,11.2 R30.P$1
N$74  (via drill 0.35)
  Top 0.3: S1.3 156.8,20.4 151.5,25.7 v145.6,25.7 | v140.3,25.7 133.4,25.7 v133,26.1 | v125,26.2 124.1,25.3 40.6,25.3 38.8,23.5 38.8,22.8 40,21.6 41.5,21.6 42.4,20.7 42.4,16.6 40.6,14.8 40.6,13.3 v39.5,12.2 | v21.5,10.8 18.33,7.63 U$35.D13
  Bottom 0.3: v145.6,25.7 v140.3,25.7 | v133,26.1 125.1,26.1 v125,26.2 | v39.5,12.2 22.9,12.2 v21.5,10.8 | JP3.1 156.8,14.73 S1.3
N$75  (via drill 0.35)
  Top 0.3: 158.8,15.9 158.8,19.9 152.1,26.6 v144.2,26.6 | v139.9,26.6 133.7,26.6 v133.1,27.2 | v125.9,27 123.8,27 122.8,26 40.2,26 38.1,23.9 38.1,22.5 39.9,20.7 39.9,14.1 v39.1,13.3 | v20.5,11.6 16.9,8 16.9,2.7 17.6,2 24.9,2 25.95,3.05 U$35.A0 | 158.8,15.9 166.37,15.9 167.97,14.3 JP2.1 | 158.8,15.9 153.7,10.8 S2.3
  Bottom 0.3: v144.2,26.6 v139.9,26.6 | v133.1,27.2 126.1,27.2 v125.9,27 | v39.1,13.3 38.7,12.9 21.8,12.9 v20.5,11.6
N$76
  Top 0.6: T6.C 114.3,15.49 U$49.GND
N$77
  Top 0.6: T5.C 111.54,19.36 108.74,16.56 107.76,16.56 107.3,16.1 U$48.GND
N$78
  Top 0.6: T4.C 100.3,17.49 U$47.GND
N$79  (via drill 0.35)
  Top 0.2: R3.P$1 20.59,48.62 J3_.2 | v31.7,53.6 39.53,53.6 41.51,55.58 41.51,56.68 41.91,57.09 42.98,57.09 U$1.A2
  Bottom 0.2: v31.7,53.6 25.99,53.6 R3.P$1
N$80  (via drill 0.35)
  Top 0.2: R2.P$1 23.59,48.52 J4_.2 | U$1.A3 43.03,57.69 44.14,57.69 44.8,57.03 44.8,55.4 44.01,54.61 43.72,54.61 42.62,53.51 42.62,53.32 40.4,51.1 35.67,51.1 31.6,47.03 v31.6,46.83
  Bottom 0.2: v31.6,46.83 25.28,46.83 R2.P$1
N$81
  Top 0.2: J5_.2 26.59,48.52 R1.P$1 28.91,46.2 31.9,46.2 32.3,46.6 32.3,47 36,50.7 40.6,50.7 42.97,53.07 42.97,53.36 43.87,54.26 44.2,54.26 45.2,55.26 45.2,57.38 44.17,58.41 43.04,58.41 U$1.A4
N$82  (via drill 0.35)
  Top 0.2: v32,36.4 36.9,36.4 37.98,35.31 42.91,35.31 43.83,36.24 43.83,36.96 43.22,37.57 U$18.A0 | v14.7,36.2 14.59,36.09 J7_.2 13.6,33.01 13.6,29.9 14.5,29 15.6,29 16.5,29.9 16.5,30.9 17.2,31.6 19.1,31.6 20.29,30.41 R10.P$1
  Bottom 0.2: v32,36.4 14.9,36.4 v14.7,36.2
N$83  (via drill 0.35)
  Top 0.2: U$18.A1 43.81,38.22 44.18,37.84 44.18,35.69 43.25,34.76 37.74,34.76 36.73,35.77 v32.8,35.77 | v17.6,35.7 J8_.2
  Bottom 0.2: v32.8,35.77 17.67,35.77 v17.6,35.7 17.9,35.7 18.4,35.2 18.4,34.5 19.81,33.09 19.81,29.92 20.51,29.22 24.49,29.22 25.69,30.41 R9.P$1
N$84  (via drill 0.35)
  Top 0.2: U$18.A2 43.81,38.87 44.53,38.14 44.53,35.25 43.59,34.3 37.4,34.3 36.4,35.3 33.86,35.3 v33.7,35.14 | v19.5,35.1 20.3,35.1 20.59,34.81 J9_.2 | R8.P$1 23.21,31.2 v22.5,31.2
  Bottom 0.2: v33.7,35.14 22.1,35.14 | 22.1,35.14 19.54,35.14 v19.5,35.1 | v22.5,31.2 22.5,34.74 22.1,35.14
N$85
  Top 0.2: U$18.A3 43.19,39.33 43.99,39.33 44.95,38.38 44.95,34.85 43.9,33.8 37.11,33.8 36.5,34.41 32.41,34.41 31.7,33.7 31.7,32.3 31.3,31.9 24.1,31.9 24,32 | 24,32 23.59,32.41 J10_.2 | R7.P$1 16.59,32 24,32
N$86  (via drill 0.35)
  Top 0.2: U$18.A4 43.01,40.18 43.8,40.18 45.41,38.57 45.41,34.51 44.2,33.3 36.76,33.3 36.1,33.96 32.61,33.96 32.35,33.7 32.35,31.95 | v32.3,31.9 32.35,31.95 | J11_.2 26.84,33.76 26.84,33.26 27.5,32.6 v28.6,32.6 | R6.P$1 19.91,28.5 30.6,28.5 32.35,30.25 32.35,31.95
  Bottom 0.2: v32.3,31.9 29.3,31.9 v28.6,32.6
N$87
  Top 0.6: T3.C 93.3,18.49 U$46.GND
N$88
  Top 0.6: T2.C 86.3,19.49 U$45.GND
N$89
  Top 0.6: T1.C 79.3,20.49 U$36.GND
N$90
  Bottom 0.6: J8.1 11.22,8.05 3.19,16.08 3.19,77.34 11.15,85.3 11.15,86.1 12.2,87.15 J1.GND
N$91  (via drill 0.35)
  Top 0.6: v9.62,11.57 9.62,14.1 11.2,15.67 J8.4
  Bottom 0.6: J1.VBUS 12.85,85.11 4.49,76.75 4.49,16.62 9.58,11.53 v9.62,11.57
N$92
  Bottom 0.6: J1.D- 15.5,85.02 15.5,84.16 5.8,74.46 5.8,17.16 10.56,12.4 11.99,12.4 12.72,13.13 J8.3
N$93  (via drill 0.35)
  Top 0.6: J8.2 12.48,10.59 10.97,12.1 v10.97,13.75
  Bottom 0.6: J1.D+ 16,87.15 17.1,86.05 17.1,83.85 7.1,73.85 7.1,17.7 11.01,13.79 v10.97,13.75
N$94  (via drill 0.35)
  Top 0.3: R41.P$2 33.2,69.61 43.14,69.61 47.93,74.39 R40.P$1 | v14.3,20.4 17.3,17.4 17.3,15.5 18.35,14.45 20.35,14.45 27.8,7 32.2,7 33.57,5.63 U$35.A3
  Bottom 0.3: R41.P$2 27.39,63.8 26.1,63.8 25.2,62.9 25.2,58.45 22.85,56.1 12.9,56.1 10.6,53.8 10.6,24.2 14.3,20.5 v14.3,20.4
N$95  (via drill 0.35)
  Top 0.3: R43.P$2 31.07,70.38 42.89,70.38 46,73.49 46,76.5 48.43,78.93 R42.P$1 | v13.1,20.29 16.4,16.99 16.4,15.35 17.93,13.83 20.07,13.83 27.6,6.3 29.6,6.3 31.03,4.87 U$35.A2
  Bottom 0.3: R43.P$2 24.6,63.91 24.6,58.7 22.6,56.7 12.65,56.7 10,54.05 10,23.95 13.1,20.85 v13.1,20.29
N$96  (via drill 0.35)
  Top 0.3: v146.53,6.42 146.57,6.47 146.57,10.45 147.01,10.89 | FAN1.3 147.01,10.89 | FAN2.3 148.17,20.88 147.01,19.73 147.01,10.89
  Bottom 0.3: U$35.A6 43.35,6 54.52,6 58.43,2.1 61.67,2.1 61.99,2.42 143.57,2.42 146.53,5.38 v146.53,6.42
N$97  (via drill 0.35)
  Top 0.2: U$18.OE 35.78,40.82 35.5,41.1 35.5,42 34.3,43.2 | 34.3,43.2 33.95,43.55 33.95,47.85 35.3,49.2 v35.5,49.2 | U$1.OE 36.98,59 35.22,59 v35,58.78 | 34.3,43.2 32.8,41.7 v32.2,41.7
  Bottom 0.152: 18.25,19.16 16.25,21.16
  Bottom 0.2: v35.5,49.2 35.5,53 36.4,53.9 36.4,57.2 35,58.6 v35,58.78 | v32.2,41.7 31.7,41.2 31.7,39.1 30.8,38.2 13.6,38.2 12.1,36.7 12.1,23.7 14.64,21.16 16.25,21.16 U$35.D12 | 18.25,19.16 U$35.D12 | R52.P$1 U$35.D12
N$98  (via drill 0.35)
  Top 0.6: R13.P$2 68.67,2.64 | 68.67,2.64 77.64,2.64 | R16.P$2 77.64,2.64 | U$35.D9 25.95,13.15 v28.7,10.4 | v47.27,9.5 49.33,7.45 55.45,7.45 57.45,5.45 57.45,3.33 58.13,2.64 68.67,2.64 | 77.64,2.64 86.64,2.64 | R19.P$2 86.64,2.64 | 86.64,2.64 95.64,2.64 | 95.64,2.64 R22.P$2 | 95.64,2.64 104.64,2.64 | 104.64,2.64 R25.P$2 | 104.64,2.64 113.64,2.64 | R28.P$2 113.64,2.64 | 113.64,2.64 122.64,2.64 | 122.64,2.64 R44.P$2 | 122.64,2.64 131.64,2.64 R48.P$2
  Bottom 0.6: v28.7,10.4 46.38,10.4 v47.27,9.5
N$99  (via drill 0.35)
  Top 0.152: v43.7,22.1 43.73,22.07 U$35.D2
  Bottom 0.152: v43.7,22.1 43.7,26.2
  Bottom 0.2: 43.7,26.2 41.5,28.4 JP1.1
N$100  (via drill 0.35)
  Top 0.2: U$1.SCL 34.72,57.07 v34.6,56.95 | v33.8,39.6 34.53,38.87 U$18.SCL | U$35.A5 38.65,8.24 38.31,8.58 R37.P$2 38.25,8.58 38.25,16.75 37.4,17.6 37.4,20.77 34.6,23.57 34.6,31.63 35.67,32.7 v35.67,33.1 | v35.5,54.7 35.4,54.6 v31.9,54.6 | v25.9,57.3 23.9,59.3 v23.9,60.1 | v13,58.1 12.1,59 v12.1,60.8 | SCL.TP-1 SCL.TP-2
  Bottom 0.2: v35.67,33.1 35.67,35.57 36.6,36.5 36.6,40.6 35.9,41.3 35.1,41.3 33.8,40 v33.8,39.6 33.8,41.1 33.9,41.2 33.9,48.3 34.6,49 34.6,54.2 | 34.6,54.2 v34.6,56.95 | 34.6,54.2 35.1,54.7 v35.5,54.7 | v31.9,54.6 31.6,54.9 31.6,56.8 31.1,57.3 v25.9,57.3 | v23.9,60.1 15,60.1 v13,58.1 | v12.1,60.8 11.85,61.05 11.85,62.5 14.5,65.15 14.5,76.1 SCL.TP-1
N$101  (via drill 0.35)
  Top 0.2: U$1.SDA 36.9,56.32 33.58,56.32 v33.4,56.5 33.35,56.45 v30.8,56.45 | v33.8,38.3 33.88,38.22 U$18.SDA | R38.P$2 35.25,8.52 36.11,7.66 U$35.A4 36.11,16.59 34.9,17.8 34.9,21 33.9,22 33.9,32.3 v34.7,33.1 | v12.9,62.3 12.6,62.3 11.3,61 11.3,58.1 v12.1,57.3 | v23.1,59.1 24.8,57.4 v24.8,56.8
  Bottom 0.2: v34.7,33.1 34.7,34.55 35.28,35.13 35.28,37.58 36.2,38.5 36.2,40.46 35.76,40.9 35.24,40.9 34.8,40.46 34.8,39.5 33.7,38.4 v33.8,38.3 32.9,39.2 32.9,40.4 33.3,40.8 33.3,48.4 34,49.1 34,55.9 v33.4,56.5 | SDA.TP-1 17.35,66.75 v12.9,62.3 | v12.1,57.3 14,57.3 16,59.3 22.9,59.3 v23.1,59.1 | v24.8,56.8 25.1,56.5 29.5,56.5 29.55,56.45 v30.8,56.45 | SDA.TP-1 SDA.TP-2 | SDA.TP-1
N$102
  Bottom 0.2: R47.P$2 127.26,22.99 T7.B
N$103  (via drill 0.35)
  Top 0.2: v144.2,4.6 144.2,4.1 145.8,2.5 147.1,2.5 v147.3,2.7
  Bottom 0.2: R47.P$1 144.39,16.71 146.3,14.8 146.3,8.2 144.2,6.1 v144.2,4.6 | v147.3,2.7 145.72,1.12 54.18,1.12 52.6,2.7 52.6,5 52.1,5.5 44.9,5.5 43.73,4.33 U$35.A7
N$104
  Top 0.6: R44.P$1 129.69,9.91 128.3,11.3 123.2,11.3 122,12.5 120.7,12.5 120,13.2 U$50.RED
N$105
  Top 0.6: R45.P$1 130.09,12.3 123.8,12.3 122.7,13.4 U$50.GREEN
N$106
  Bottom 0.6: U$50.BLUE 124,14.4 127,11.4 133.99,11.4 R46.P$1
N$107
  Bottom 0.2: U$35.D8 28.49,19.99 29.8,21.3 57.89,21.3 R31.P$1
N$108
  Bottom 0.2: R31.P$2 67.91,18.9 75.77,18.9 77,20.13 T1.B
N$109
  Bottom 0.152: 84.98,20.71 T2.B
  Bottom 0.2: R32.P$2 70.16,18.35 82.62,18.35 84.98,20.71
N$110  (via drill 0.35)
  Top 0.152: v91,17.59 93,19.59 T3.B
  Bottom 0.152: v91,17.6 v91,17.59
  Bottom 0.2: v91,17.6 90.73,17.33 75.14,17.33 R33.P$2
N$111  (via drill 0.35)
  Top 0.152: v98.5,17.59 101,20.09 T4.B
  Bottom 0.2: R34.P$2 67.81,7.8 76.84,16.83 97.74,16.83 v98.5,17.59
N$112  (via drill 0.35)
  Top 0.152: v105.7,17.59 106.76,17.59 109,19.83 T5.B
  Bottom 0.2: R35.P$2 69.45,5.96 69.45,8.15 77.68,16.38 100.19,16.38 101.4,17.59 v105.7,17.59
N$113
  Bottom 0.2: R36.P$2 72.62,17.82 89.7,17.82 90.28,18.4 114.67,18.4 T6.B
N$114
  Bottom 0.2: U$35.D7 31.03,19.63 32.3,20.9 55.29,20.9 R32.P$1
N$115
  Bottom 0.2: U$35.D6 36.25,16.4 41.9,16.4 42.6,15.7 45.8,15.7 48.8,12.7 48.8,9.5 51.7,6.6 54.19,6.6 54.8,6.6 58.8,2.6 61.5,2.6 61.9,3 61.9,8.29 R33.P$1
N$116
  Bottom 0.2: U$35.D5 36.62,19.08 38.85,16.85 42.15,16.85 42.8,16.2 46,16.2 49.4,12.8 49.4,9.6 51.9,7.1 55,7.1 59.07,3.03 61.33,3.03 61.5,3.2 61.5,5.69 R34.P$1
N$117
  Bottom 0.2: U$35.D4 38.82,19.08 40.6,17.3 42.5,17.3 43.1,16.7 46.4,16.7 50,13.1 50,9.8 52.2,7.6 55.2,7.6 58.48,4.33 R35.P$1
N$118
  Bottom 0.2: U$35.D3 41.29,19.08 43.23,17.14 46.77,17.14 48.5,15.4 57.79,15.4 R36.P$1
N$119
  Top 1.5: U$37.GREEN 62.54,90.76 65.6,87.7 65.6,44.5 57.4,36.3 U$17.DRAIN
N$120
  Top 1.5: U$37.RED 60,89.3 63,86.3 63,57.5 56.8,51.3 U$16.DRAIN
N$121
  Top 1.5: U$37.WHITE 57.46,88.04 60.6,84.9 60.6,76.1 60.6,71 U$15.DRAIN
N$122
  Top 1.5: U$37.BLUE 54.92,86.68 55.9,85.7 U$14.DRAIN
N$123
  Top 0.6: T7.C 127.54,19.94 124.94,17.34 122.34,17.34 121.3,16.3 U$50.GND
N$124
  Top 1.5: U$38.GREEN 77.54,90.26 80.7,87.1 80.7,46.1 U$13.DRAIN
N$125
  Top 1.5: U$38.RED 75,89.1 78.2,85.9 78.2,58.6 U$12.DRAIN
N$126
  Top 1.5: U$38.WHITE 72.46,87.94 75.7,84.7 75.7,71.1 U$11.DRAIN
N$127
  Top 1.5: U$38.BLUE 69.92,86.68 70.9,85.7 U$10.DRAIN
N$129
  Top 1.5: U$39.GREEN 92.54,90.76 95.7,87.6 95.7,46.1 U$9.DRAIN
N$130
  Top 1.5: U$39.RED 90,89.5 93.1,86.4 93.1,58.5 U$8.DRAIN
N$131
  Top 1.5: U$39.WHITE 87.46,88.34 90.5,85.3 90.5,70.9 U$7.DRAIN
N$132
  Top 1.5: U$39.BLUE 84.92,86.58 86,85.5 86,81.4 U$6.DRAIN
N$134
  Top 1.5: U$43.GREEN 152.54,91.76 155.6,88.7 155.6,46 U$5.DRAIN
N$135
  Top 1.5: U$43.RED 150,90.2 153.1,87.1 153.1,58.5 U$4.DRAIN
N$136
  Top 1.5: U$43.WHITE 147.46,88.54 150.6,85.4 150.6,71 U$3.DRAIN
N$137  (via drill 0.35)
  Top 0.6: v73.3,9.8 73.3,18.3 67.4,24.2 v41.3,24.2 | U$35.D10 23.41,17.19 v24.2,16.4 | v28,16.4 30.8,16.4 32.3,17.9 32.3,20.7 32.8,21.2 v32.8,24.3
  Bottom 0.6: R14.P$2 73.28,6.4 73.31,6.4 | 73.31,6.4 v73.31,9.79 v73.3,9.8 | v41.3,24.2 32.9,24.2 v32.8,24.3 | v24.2,16.4 v28,16.4 | 73.31,6.4 80.21,6.4 | R17.P$2 80.21,6.4 | 80.21,6.4 89.21,6.4 | R20.P$2 89.21,6.4 | 89.21,6.4 98.21,6.4 | R23.P$2 98.21,6.4 | 98.21,6.4 107.21,6.4 | R29.P$2 116.21,6.4 | R45.P$2 125.21,6.4 | 125.21,6.4 134.21,6.4 R49.P$2 | R26.P$2 107.21,6.4 | 107.21,6.4 116.21,6.4 | 116.21,6.4 125.21,6.4
N$138
  Bottom 0.6: T8.B 133,19.5 134.7,17.8 138.21,17.8 R51.P$2
N$139  (via drill 0.35)
  Top 0.2: v146,3.6 145.3,4.3 145.3,7.1 146,7.8 146,12 R51.P$1 | v55.2,2 47.9,2 v47.6,2.3 | R51.P$1
  Bottom 0.2: v146,3.6 144.2,1.8 62.2,1.8 62,1.6 55.6,1.6 v55.2,2 | v47.6,2.3 46.67,2.3 46.65,2.28 45.9,2.28 45.87,2.3 45.3,2.3 45,2 30.33,2 U$35.A1
N$140
  Bottom 0.6: R48.P$1 138.69,9.71 135.7,12.7 127.5,12.7 127,13.2 U$51.RED
N$141
  Top 0.6: U$51.GREEN 129.7,16.1 130.42,16.82 134.57,16.82 R49.P$1
N$142
  Bottom 0.6: U$51.BLUE 139.69,14.7 R50.P$1
N$143
  Top 0.6: U$51.GND 128.3,16.4 130,18.1 134.4,18.1 135.54,19.24 T8.C

## Text on the board
tPlace: USB_B | B | W | R | G | + | B | W | R | G | + | B | W | R | G | + | B | W | R | G | + | B | W | R | G | + | B | W | R | G | + | B | W | R | G | + | B | W | R | G | + | CH. 1 | CH. 2 | CH. 3 | CH. 4 | CH. 5 | CH. 6 | CH. 7 | CH. 8 | GND | 12V | JLCJLCJLCJLC | TMP1 | GND | TMP2 | PWM A | C1 2200uf | FOR PWM A | B1 | B2 | B3 | B4 | B5 | B6 | PWM B | FOR PWM B | B1 | B2 | B3 | B4 | B5 | B6 | GND | KILL | MODE | S1 | R31 | 1K | Ch. 1 | Ch. 2 | Ch. 3 | Ch. 4 | Ch. 5 | Ch. 6 | Ch. 7 | Ch. 8 | R32 | 1K | C | C | C | C | C | C | C | C | VBUS | MODE | SPEED | D- | R33 | 1K | 5MM_RGB | 5MM_RGB | 5MM_RGB | 5MM_RGB | 5MM_RGB | 5MM_RGB | 5MM_RGB | 5MM_RGB | D+ | R34 | 1K | GND | GND | R35 | 1K | S2 | R36 | 1K | SPEED